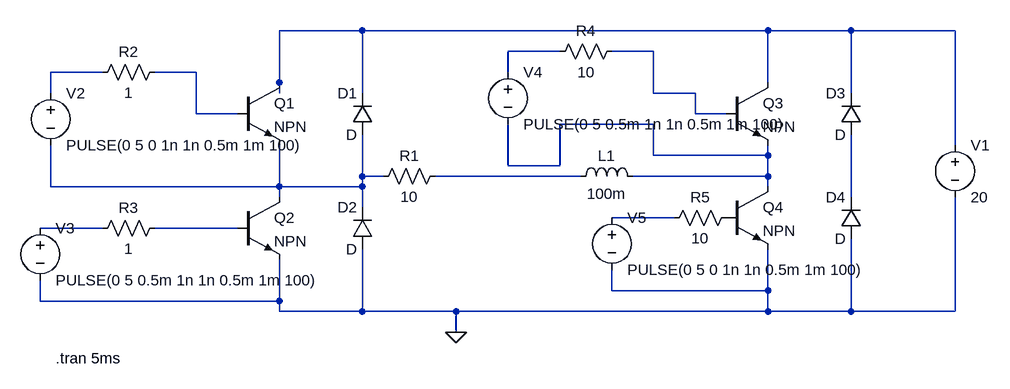
[diagram p0: schematic FullWave_Inverter_RL.asc]
FullWave_Inverter_RL.asc, the LTspice schematic file:
Version 4
SHEET 1 1068 756
WIRE 96 80 -32 80
WIRE 720 80 96 80
WIRE 848 80 720 80
WIRE 1008 80 848 80
WIRE 400 112 320 112
WIRE 544 112 480 112
WIRE -304 144 -384 144
WIRE -160 144 -224 144
WIRE 320 144 320 112
WIRE -32 160 -32 80
WIRE 720 160 720 80
WIRE -384 176 -384 144
WIRE -32 176 -32 160
WIRE 96 176 96 80
WIRE 544 176 544 112
WIRE 608 176 544 176
WIRE 848 176 848 80
WIRE -160 208 -160 144
WIRE -96 208 -160 208
WIRE 608 208 608 176
WIRE 656 208 608 208
WIRE 544 224 400 224
WIRE 1008 256 1008 80
WIRE 544 272 544 224
WIRE 720 272 720 256
WIRE 720 272 544 272
WIRE 320 288 320 224
WIRE 400 288 400 224
WIRE 400 288 320 288
WIRE 96 304 96 240
WIRE 128 304 96 304
WIRE 432 304 208 304
WIRE 720 304 720 272
WIRE 720 304 512 304
WIRE -384 320 -384 256
WIRE -32 320 -32 256
WIRE -32 320 -384 320
WIRE 96 320 96 304
WIRE 96 320 -32 320
WIRE 720 320 720 304
WIRE -32 336 -32 320
WIRE 848 336 848 240
WIRE 96 352 96 320
WIRE 576 368 480 368
WIRE -304 384 -400 384
WIRE -96 384 -224 384
WIRE 480 480 480 448
WIRE 720 480 720 416
WIRE 720 480 480 480
WIRE -400 496 -400 464
WIRE -32 496 -32 432
WIRE -32 496 -400 496
WIRE -32 512 -32 496
WIRE 96 512 96 416
WIRE 96 512 -32 512
WIRE 240 512 96 512
WIRE 720 512 720 480
WIRE 720 512 240 512
WIRE 848 512 848 400
WIRE 848 512 720 512
WIRE 1008 512 1008 336
WIRE 1008 512 848 512
WIRE 240 544 240 512
FLAG 240 544 0
SYMBOL diode 112 240 R180
WINDOW 0 24 64 Left 2
WINDOW 3 24 0 Left 2
SYMATTR InstName D1
SYMBOL diode 112 416 R180
WINDOW 0 24 64 Left 2
WINDOW 3 24 0 Left 2
SYMATTR InstName D2
SYMBOL diode 864 240 R180
WINDOW 0 24 64 Left 2
WINDOW 3 24 0 Left 2
SYMATTR InstName D3
SYMBOL diode 864 400 R180
WINDOW 0 24 64 Left 2
WINDOW 3 24 0 Left 2
SYMATTR InstName D4
SYMBOL npn -96 160 R0
SYMATTR InstName Q1
SYMBOL npn -96 336 R0
SYMATTR InstName Q2
SYMBOL npn 656 160 R0
SYMATTR InstName Q3
SYMBOL npn 656 320 R0
SYMATTR InstName Q4
SYMBOL res 224 288 R90
WINDOW 0 0 56 VBottom 2
WINDOW 3 32 56 VTop 2
SYMATTR InstName R1
SYMATTR Value 10
SYMBOL voltage 1008 240 R0
SYMATTR InstName V1
SYMATTR Value 20
SYMBOL voltage -384 160 R0
SYMATTR InstName V2
SYMATTR Value PULSE(0 5 0 1n 1n 0.5m 1m 100)
SYMBOL voltage -400 368 R0
SYMATTR InstName V3
SYMATTR Value PULSE(0 5 0.5m 1n 1n 0.5m 1m 100)
SYMBOL res -208 128 R90
WINDOW 0 0 56 VBottom 2
WINDOW 3 32 56 VTop 2
SYMATTR InstName R2
SYMATTR Value 1
SYMBOL res -320 400 R270
WINDOW 0 32 56 VTop 2
WINDOW 3 0 56 VBottom 2
SYMATTR InstName R3
SYMATTR Value 1
SYMBOL voltage 320 128 R0
SYMATTR InstName V4
SYMATTR Value PULSE(0 5 0.5m 1n 1n 0.5m 1m 100)
SYMBOL res 496 96 R90
WINDOW 0 0 56 VBottom 2
WINDOW 3 32 56 VTop 2
SYMATTR InstName R4
SYMATTR Value 10
SYMBOL voltage 480 352 R0
SYMATTR InstName V5
SYMATTR Value PULSE(0 5 0 1n 1n 0.5m 1m 100)
SYMBOL res 560 384 R270
WINDOW 0 32 56 VTop 2
WINDOW 3 0 56 VBottom 2
SYMATTR InstName R5
SYMATTR Value 10
SYMBOL ind 416 320 R270
WINDOW 0 32 56 VTop 2
WINDOW 3 5 56 VBottom 2
SYMATTR InstName L1
SYMATTR Value 100m
TEXT -376 584 Left 2 !.tran 5ms

The netlist it stands for:
* FullWave_Inverter_RL.asc
D1 N007 N001 D
D2 0 N007 D
D3 N009 N001 D
D4 0 N009 D
Q1 N001 N005 N007 0 NPN
Q2 N007 N012 0 0 NPN
Q3 N001 N003 N006 0 NPN
Q4 N006 P001 0 0 NPN
R1 N008 N007 10
V1 N001 0 20
V2 N004 N007 PULSE(0 5 0 1n 1n 0.5m 1m 100)
V3 N011 0 PULSE(0 5 0.5m 1n 1n 0.5m 1m 100)
R2 N005 N004 1
R3 N011 N012 1
V4 N002 N006 PULSE(0 5 0.5m 1n 1n 0.5m 1m 100)
R4 N003 N002 10
V5 N010 0 PULSE(0 5 0 1n 1n 0.5m 1m 100)
R5 N010 P001 10
L1 N008 N006 100m
.model D D
.lib standard.dio
.model NPN NPN
.model PNP PNP
.lib standard.bjt
.tran 5ms
.backanno
.end